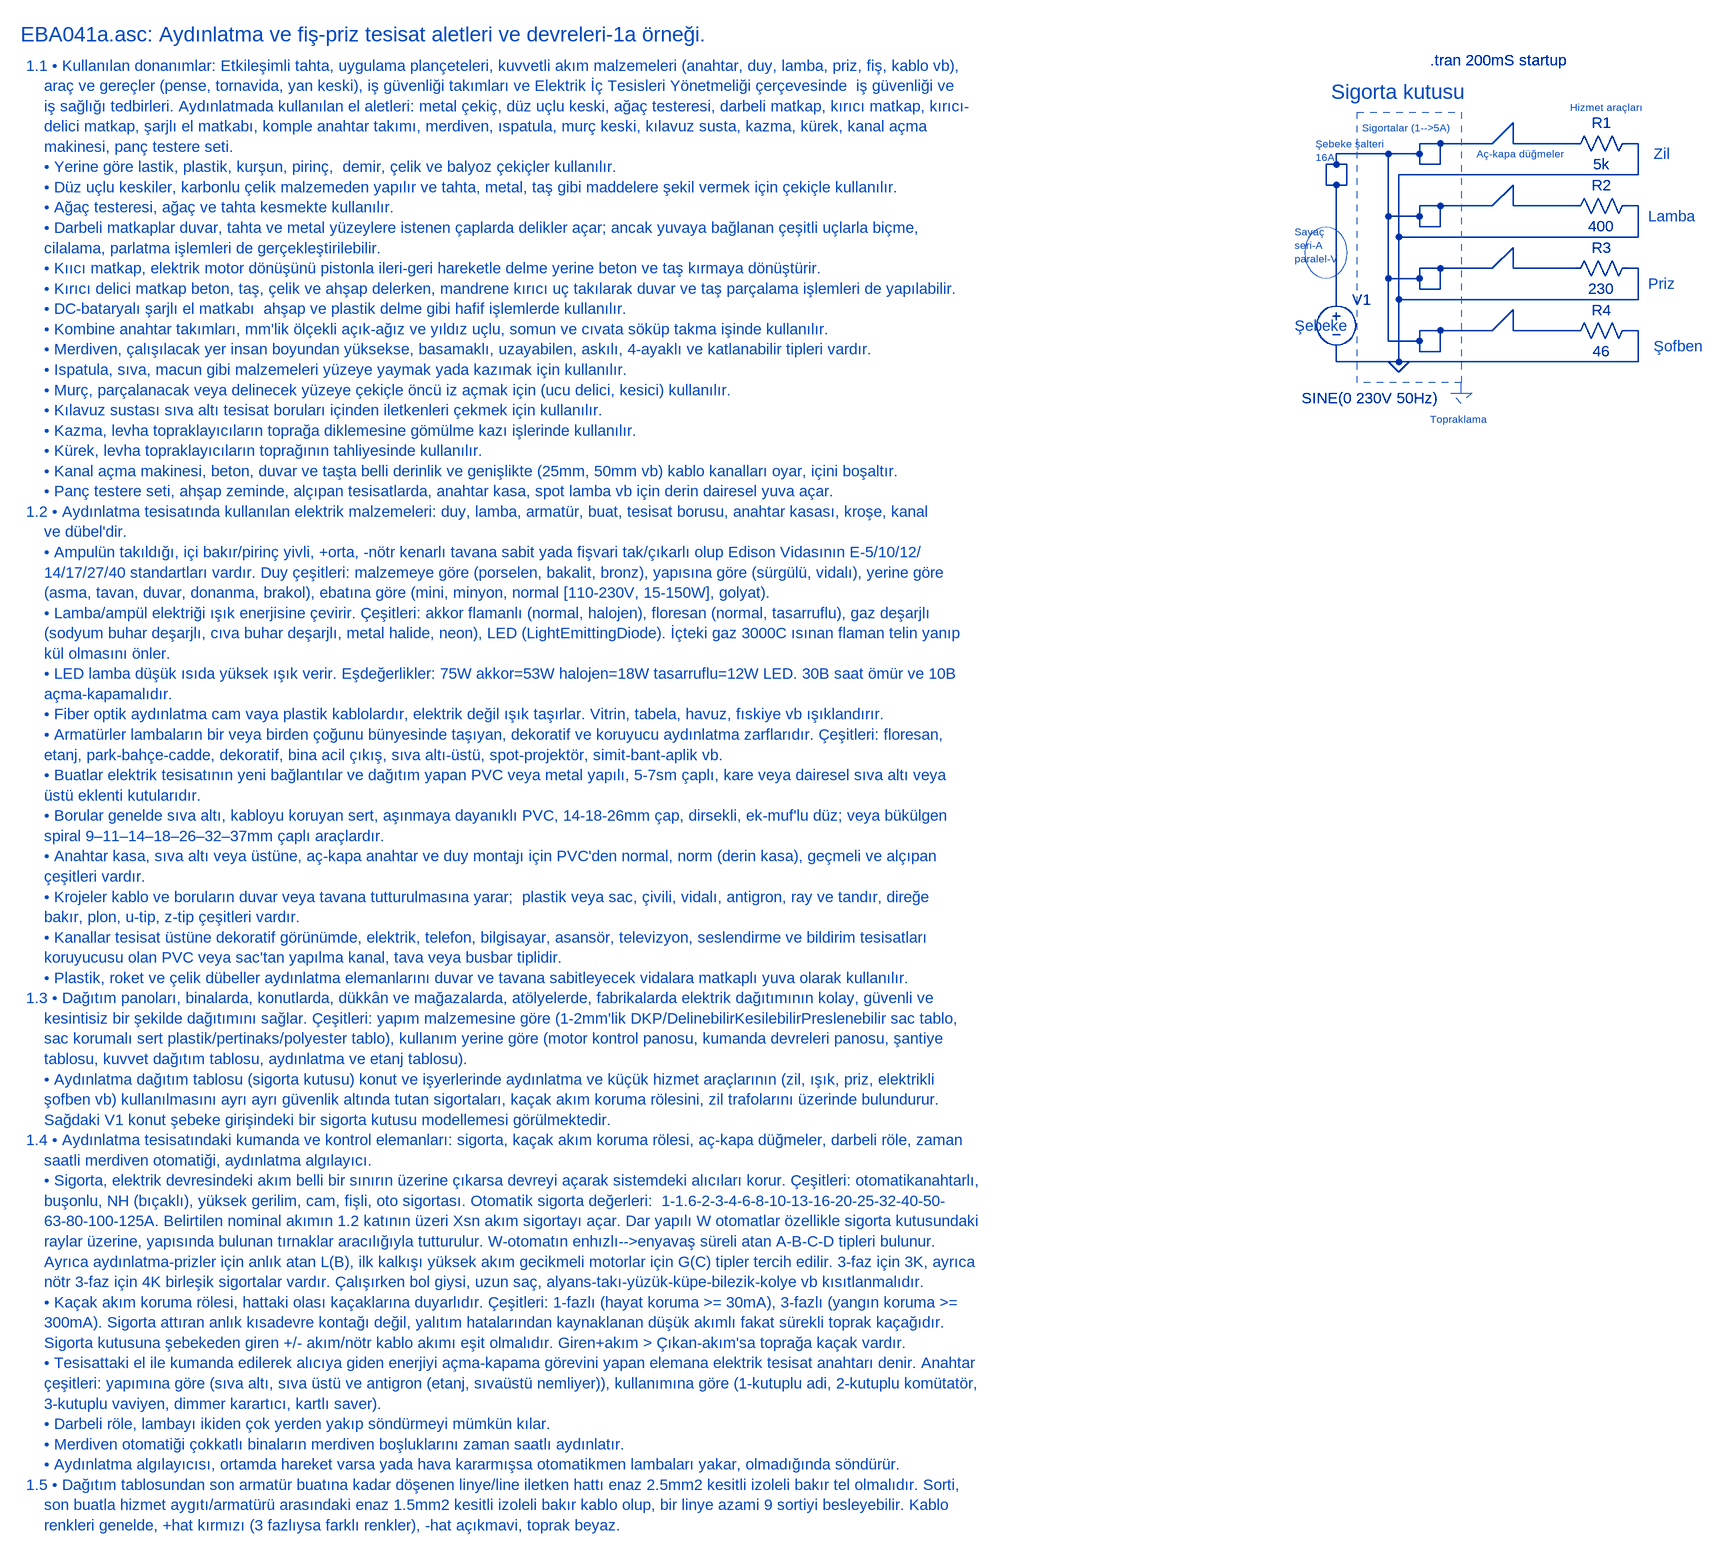
[diagram p0: schematic EBA041a.asc]
EBA041a.asc, the LTspice schematic file:
Version 4
SHEET 1 3956 2148
WIRE 2032 208 2000 208
WIRE 2112 208 2144 176
WIRE 2112 208 2032 208
WIRE 2144 208 2144 176
WIRE 2240 208 2144 208
WIRE 2336 208 2320 208
WIRE 1952 224 1872 224
WIRE 2000 224 2000 208
WIRE 2000 224 1952 224
WIRE 1872 240 1872 224
WIRE 1872 240 1856 240
WIRE 1888 240 1872 240
WIRE 2000 240 2000 224
WIRE 2032 240 2032 208
WIRE 2032 240 2000 240
WIRE 2336 256 2336 208
WIRE 2336 256 1968 256
WIRE 1856 272 1856 240
WIRE 1872 272 1856 272
WIRE 1888 272 1888 240
WIRE 1888 272 1872 272
WIRE 2032 304 2000 304
WIRE 2112 304 2144 272
WIRE 2112 304 2032 304
WIRE 2144 304 2144 272
WIRE 2240 304 2144 304
WIRE 2336 304 2320 304
WIRE 1952 320 1952 224
WIRE 2000 320 2000 304
WIRE 2000 320 1952 320
WIRE 2000 336 2000 320
WIRE 2032 336 2032 304
WIRE 2032 336 2000 336
WIRE 1968 352 1968 256
WIRE 2336 352 2336 304
WIRE 2336 352 1968 352
WIRE 2032 400 2000 400
WIRE 2112 400 2144 368
WIRE 2112 400 2032 400
WIRE 2144 400 2144 368
WIRE 2240 400 2144 400
WIRE 2336 400 2320 400
WIRE 1952 416 1952 320
WIRE 2000 416 2000 400
WIRE 2000 416 1952 416
WIRE 2000 432 2000 416
WIRE 2032 432 2032 400
WIRE 2032 432 2000 432
WIRE 1872 448 1872 272
WIRE 1968 448 1968 352
WIRE 2336 448 2336 400
WIRE 2336 448 1968 448
WIRE 2032 496 2000 496
WIRE 2112 496 2144 464
WIRE 2112 496 2032 496
WIRE 2144 496 2144 464
WIRE 2240 496 2144 496
WIRE 2336 496 2320 496
WIRE 1952 512 1952 416
WIRE 2000 512 2000 496
WIRE 2000 512 1952 512
WIRE 2000 528 2000 512
WIRE 2032 528 2032 496
WIRE 2032 528 2000 528
WIRE 1872 544 1872 528
WIRE 1968 544 1968 448
WIRE 1968 544 1872 544
WIRE 2336 544 2336 496
WIRE 2336 544 1968 544
FLAG 1968 544 0
SYMBOL voltage 1872 432 R0
WINDOW 3 -53 168 Left 2
WINDOW 123 0 0 Left 0
WINDOW 39 0 0 Left 0
SYMATTR Value SINE(0 230V 50Hz)
SYMATTR InstName V1
SYMBOL res 2336 192 R90
WINDOW 0 0 56 VBottom 2
WINDOW 3 32 56 VTop 2
SYMATTR InstName R1
SYMATTR Value 5k
SYMBOL res 2336 288 R90
WINDOW 0 0 56 VBottom 2
WINDOW 3 32 56 VTop 2
SYMATTR InstName R2
SYMATTR Value 400
SYMBOL res 2336 384 R90
WINDOW 0 0 56 VBottom 2
WINDOW 3 32 56 VTop 2
SYMATTR InstName R3
SYMATTR Value 230
SYMBOL res 2336 480 R90
WINDOW 0 0 56 VBottom 2
WINDOW 3 32 56 VTop 2
SYMATTR InstName R4
SYMATTR Value 46
TEXT -152 40 Left 3 ;EBA041a.asc: Aydınlatma ve fiş-priz tesisat aletleri ve devreleri-1a örneği.
TEXT -144 88 Left 2 ;1.1 • Kullanılan donanımlar: Etkileşimli tahta, uygulama plançeteleri, kuvvetli akım malzemeleri (anahtar, duy, lamba, priz, fiş, kablo vb),\n    araç ve gereçler (pense, tornavida, yan keski), iş güvenliği takımları ve Elektrik İç Tesisleri Yönetmeliği çerçevesinde  iş güvenliği ve\n    iş sağlığı tedbirleri. Aydınlatmada kullanılan el aletleri: metal çekiç, düz uçlu keski, ağaç testeresi, darbeli matkap, kırıcı matkap, kırıcı-\n    delici matkap, şarjlı el matkabı, komple anahtar takımı, merdiven, ıspatula, murç keski, kılavuz susta, kazma, kürek, kanal açma \n    makinesi, panç testere seti.\n    • Yerine göre lastik, plastik, kurşun, pirinç,  demir, çelik ve balyoz çekiçler kullanılır.\n    • Düz uçlu keskiler, karbonlu çelik malzemeden yapılır ve tahta, metal, taş gibi maddelere şekil vermek için çekiçle kullanılır.\n    • Ağaç testeresi, ağaç ve tahta kesmekte kullanılır.\n    • Darbeli matkaplar duvar, tahta ve metal yüzeylere istenen çaplarda delikler açar; ancak yuvaya bağlanan çeşitli uçlarla biçme, \n    cilalama, parlatma işlemleri de gerçekleştirilebilir.\n    • Kııcı matkap, elektrik motor dönüşünü pistonla ileri-geri hareketle delme yerine beton ve taş kırmaya dönüştürir.\n    • Kırıcı delici matkap beton, taş, çelik ve ahşap delerken, mandrene kırıcı uç takılarak duvar ve taş parçalama işlemleri de yapılabilir.\n    • DC-bataryalı şarjlı el matkabı  ahşap ve plastik delme gibi hafif işlemlerde kullanılır.\n    • Kombine anahtar takımları, mm'lik ölçekli açık-ağız ve yıldız uçlu, somun ve cıvata söküp takma işinde kullanılır.\n    • Merdiven, çalışılacak yer insan boyundan yüksekse, basamaklı, uzayabilen, askılı, 4-ayaklı ve katlanabilir tipleri vardır.\n    • Ispatula, sıva, macun gibi malzemeleri yüzeye yaymak yada kazımak için kullanılır.\n    • Murç, parçalanacak veya delinecek yüzeye çekiçle öncü iz açmak için (ucu delici, kesici) kullanılır.\n    • Kılavuz sustası sıva altı tesisat boruları içinden iletkenleri çekmek için kullanılır.\n    • Kazma, levha topraklayıcıların toprağa diklemesine gömülme kazı işlerinde kullanılır.\n    • Kürek, levha topraklayıcıların toprağının tahliyesinde kullanılır.\n    • Kanal açma makinesi, beton, duvar ve taşta belli derinlik ve genişlikte (25mm, 50mm vb) kablo kanalları oyar, içini boşaltır.\n    • Panç testere seti, ahşap zeminde, alçıpan tesisatlarda, anahtar kasa, spot lamba vb için derin dairesel yuva açar.\n1.2 • Aydınlatma tesisatında kullanılan elektrik malzemeleri: duy, lamba, armatür, buat, tesisat borusu, anahtar kasası, kroşe, kanal\n    ve dübel'dir.\n    • Ampulün takıldığı, içi bakır/pirinç yivli, +orta, -nötr kenarlı tavana sabit yada fişvari tak/çıkarlı olup Edison Vidasının E-5/10/12/\n    14/17/27/40 standartları vardır. Duy çeşitleri: malzemeye göre (porselen, bakalit, bronz), yapısına göre (sürgülü, vidalı), yerine göre\n    (asma, tavan, duvar, donanma, brakol), ebatına göre (mini, minyon, normal [110-230V, 15-150W], golyat).\n    • Lamba/ampül elektriği ışık enerjisine çevirir. Çeşitleri: akkor flamanlı (normal, halojen), floresan (normal, tasarruflu), gaz deşarjlı \n    (sodyum buhar deşarjlı, cıva buhar deşarjlı, metal halide, neon), LED (LightEmittingDiode). İçteki gaz 3000C ısınan flaman telin yanıp\n    kül olmasını önler.\n    • LED lamba düşük ısıda yüksek ışık verir. Eşdeğerlikler: 75W akkor=53W halojen=18W tasarruflu=12W LED. 30B saat ömür ve 10B \n    açma-kapamalıdır.\n    • Fiber optik aydınlatma cam vaya plastik kablolardır, elektrik değil ışık taşırlar. Vitrin, tabela, havuz, fıskiye vb ışıklandırır.\n    • Armatürler lambaların bir veya birden çoğunu bünyesinde taşıyan, dekoratif ve koruyucu aydınlatma zarflarıdır. Çeşitleri: floresan,\n    etanj, park-bahçe-cadde, dekoratif, bina acil çıkış, sıva altı-üstü, spot-projektör, simit-bant-aplik vb.\n    • Buatlar elektrik tesisatının yeni bağlantılar ve dağıtım yapan PVC veya metal yapılı, 5-7sm çaplı, kare veya dairesel sıva altı veya\n    üstü eklenti kutularıdır.\n    • Borular genelde sıva altı, kabloyu koruyan sert, aşınmaya dayanıklı PVC, 14-18-26mm çap, dirsekli, ek-muf'lu düz; veya bükülgen\n    spiral 9–11–14–18–26–32–37mm çaplı araçlardır.\n    • Anahtar kasa, sıva altı veya üstüne, aç-kapa anahtar ve duy montajı için PVC'den normal, norm (derin kasa), geçmeli ve alçıpan\n    çeşitleri vardır.\n    • Krojeler kablo ve boruların duvar veya tavana tutturulmasına yarar;  plastik veya sac, çivili, vidalı, antigron, ray ve tandır, direğe\n    bakır, plon, u-tip, z-tip çeşitleri vardır.\n    • Kanallar tesisat üstüne dekoratif görünümde, elektrik, telefon, bilgisayar, asansör, televizyon, seslendirme ve bildirim tesisatları\n    koruyucusu olan PVC veya sac'tan yapılma kanal, tava veya busbar tiplidir.\n    • Plastik, roket ve çelik dübeller aydınlatma elemanlarını duvar ve tavana sabitleyecek vidalara matkaplı yuva olarak kullanılır.\n1.3 • Dağıtım panoları, binalarda, konutlarda, dükkân ve mağazalarda, atölyelerde, fabrikalarda elektrik dağıtımının kolay, güvenli ve\n    kesintisiz bir şekilde dağıtımını sağlar. Çeşitleri: yapım malzemesine göre (1-2mm'lik DKP/DelinebilirKesilebilirPreslenebilir sac tablo,\n    sac korumalı sert plastik/pertinaks/polyester tablo), kullanım yerine göre (motor kontrol panosu, kumanda devreleri panosu, şantiye\n    tablosu, kuvvet dağıtım tablosu, aydınlatma ve etanj tablosu).\n    • Aydınlatma dağıtım tablosu (sigorta kutusu) konut ve işyerlerinde aydınlatma ve küçük hizmet araçlarının (zil, ışık, priz, elektrikli \n    şofben vb) kullanılmasını ayrı ayrı güvenlik altında tutan sigortaları, kaçak akım koruma rölesini, zil trafolarını üzerinde bulundurur.\n    Sağdaki V1 konut şebeke girişindeki bir sigorta kutusu modellemesi görülmektedir.\n1.4 • Aydınlatma tesisatındaki kumanda ve kontrol elemanları: sigorta, kaçak akım koruma rölesi, aç-kapa düğmeler, darbeli röle, zaman\n    saatli merdiven otomatiği, aydınlatma algılayıcı.\n    • Sigorta, elektrik devresindeki akım belli bir sınırın üzerine çıkarsa devreyi açarak sistemdeki alıcıları korur. Çeşitleri: otomatikanahtarlı,\n    buşonlu, NH (bıçaklı), yüksek gerilim, cam, fişli, oto sigortası. Otomatik sigorta değerleri:  1-1.6-2-3-4-6-8-10-13-16-20-25-32-40-50-\n    63-80-100-125A. Belirtilen nominal akımın 1.2 katının üzeri Xsn akım sigortayı açar. Dar yapılı W otomatlar özellikle sigorta kutusundaki \n    raylar üzerine, yapısında bulunan tırnaklar aracılığıyla tutturulur. W-otomatın enhızlı-->enyavaş süreli atan A-B-C-D tipleri bulunur.\n    Ayrıca aydınlatma-prizler için anlık atan L(B), ilk kalkışı yüksek akım gecikmeli motorlar için G(C) tipler tercih edilir. 3-faz için 3K, ayrıca\n    nötr 3-faz için 4K birleşik sigortalar vardır. Çalışırken bol giysi, uzun saç, alyans-takı-yüzük-küpe-bilezik-kolye vb kısıtlanmalıdır.\n    • Kaçak akım koruma rölesi, hattaki olası kaçaklarına duyarlıdır. Çeşitleri: 1-fazlı (hayat koruma >= 30mA), 3-fazlı (yangın koruma >=\n    300mA). Sigorta attıran anlık kısadevre kontağı değil, yalıtım hatalarından kaynaklanan düşük akımlı fakat sürekli toprak kaçağıdır.\n    Sigorta kutusuna şebekeden giren +/- akım/nötr kablo akımı eşit olmalıdır. Giren+akım > Çıkan-akım'sa toprağa kaçak vardır.\n    • Tesisattaki el ile kumanda edilerek alıcıya giden enerjiyi açma-kapama görevini yapan elemana elektrik tesisat anahtarı denir. Anahtar\n    çeşitleri: yapımına göre (sıva altı, sıva üstü ve antigron (etanj, sıvaüstü nemliyer)), kullanımına göre (1-kutuplu adi, 2-kutuplu komütatör,\n    3-kutuplu vaviyen, dimmer karartıcı, kartlı saver).\n    • Darbeli röle, lambayı ikiden çok yerden yakıp söndürmeyi mümkün kılar.\n    • Merdiven otomatiği çokkatlı binaların merdiven boşluklarını zaman saatlı aydınlatır.\n    • Aydınlatma algılayıcısı, ortamda hareket varsa yada hava kararmışsa otomatikmen lambaları yakar, olmadığında söndürür.\n1.5 • Dağıtım tablosundan son armatür buatına kadar döşenen linye/line iletken hattı enaz 2.5mm2 kesitli izoleli bakır tel olmalıdır. Sorti, \n    son buatla hizmet aygıtı/armatürü arasındaki enaz 1.5mm2 kesitli izoleli bakır kablo olup, bir linye azami 9 sortiyi besleyebilir. Kablo \n    renkleri genelde, +hat kırmızı (3 fazlıysa farklı renkler), -hat açıkmavi, toprak beyaz.
TEXT 1912 184 Left 1 ;Sigortalar (1-->5A)
TEXT 2088 224 Left 1 ;Aç-kapa düğmeler
TEXT 2232 152 Left 1 ;Hizmet araçları
TEXT 2360 224 Left 2 ;Zil
TEXT 2352 320 Left 2 ;Lamba
TEXT 2352 424 Left 2 ;Priz
TEXT 2360 520 Left 2 ;Şofben
TEXT 1864 128 Left 3 ;Sigorta kutusu
TEXT 2016 632 Left 1 ;Topraklama
TEXT 2016 80 Left 2 !.tran 200mS startup
TEXT 1808 344 Left 1 ;Sayaç\nseri-A\nparalel-V
TEXT 1840 208 Left 1 ;Şebeke şalteri\n16A
TEXT 1808 488 Left 2 ;Şebeke
LINE Normal 2064 592 2064 576 2
LINE Normal 2048 592 2064 592 2
LINE Normal 2064 608 2048 592 2
LINE Normal 2080 592 2064 608 2
LINE Normal 2064 592 2080 592 2
RECTANGLE Normal 2064 576 1904 160 2
CIRCLE Normal 1888 416 1824 336 2

The netlist it stands for:
* EBA041a.asc
V1 N001 0 SINE(0 230V 50Hz)
R1 0 N001 5k
R2 0 N001 400
R3 0 N001 230
R4 0 N001 46
* EBA041a.asc: Aydınlatma ve fiş-priz tesisat aletleri ve devreleri-1a örneği.
* 1.1 • Kullanılan donanımlar: Etkileşimli tahta, uygulama plançeteleri, kuvvetli akım malzemeleri (anahtar, duy, lamba, priz, fiş, kablo vb),
*     araç ve gereçler (pense, tornavida, yan keski), iş güvenliği takımları ve Elektrik İç Tesisleri Yönetmeliği çerçevesinde  iş güvenliği ve
*     iş sağlığı tedbirleri. Aydınlatmada kullanılan el aletleri: metal çekiç, düz uçlu keski, ağaç testeresi, darbeli matkap, kırıcı matkap, kırıcı-
*     delici matkap, şarjlı el matkabı, komple anahtar takımı, merdiven, ıspatula, murç keski, kılavuz susta, kazma, kürek, kanal açma
*     makinesi, panç testere seti.
*     • Yerine göre lastik, plastik, kurşun, pirinç,  demir, çelik ve balyoz çekiçler kullanılır.
*     • Düz uçlu keskiler, karbonlu çelik malzemeden yapılır ve tahta, metal, taş gibi maddelere şekil vermek için çekiçle kullanılır.
*     • Ağaç testeresi, ağaç ve tahta kesmekte kullanılır.
*     • Darbeli matkaplar duvar, tahta ve metal yüzeylere istenen çaplarda delikler açar; ancak yuvaya bağlanan çeşitli uçlarla biçme,
*     cilalama, parlatma işlemleri de gerçekleştirilebilir.
*     • Kııcı matkap, elektrik motor dönüşünü pistonla ileri-geri hareketle delme yerine beton ve taş kırmaya dönüştürir.
*     • Kırıcı delici matkap beton, taş, çelik ve ahşap delerken, mandrene kırıcı uç takılarak duvar ve taş parçalama işlemleri de yapılabilir.
*     • DC-bataryalı şarjlı el matkabı  ahşap ve plastik delme gibi hafif işlemlerde kullanılır.
*     • Kombine anahtar takımları, mm'lik ölçekli açık-ağız ve yıldız uçlu, somun ve cıvata söküp takma işinde kullanılır.
*     • Merdiven, çalışılacak yer insan boyundan yüksekse, basamaklı, uzayabilen, askılı, 4-ayaklı ve katlanabilir tipleri vardır.
*     • Ispatula, sıva, macun gibi malzemeleri yüzeye yaymak yada kazımak için kullanılır.
*     • Murç, parçalanacak veya delinecek yüzeye çekiçle öncü iz açmak için (ucu delici, kesici) kullanılır.
*     • Kılavuz sustası sıva altı tesisat boruları içinden iletkenleri çekmek için kullanılır.
*     • Kazma, levha topraklayıcıların toprağa diklemesine gömülme kazı işlerinde kullanılır.
*     • Kürek, levha topraklayıcıların toprağının tahliyesinde kullanılır.
*     • Kanal açma makinesi, beton, duvar ve taşta belli derinlik ve genişlikte (25mm, 50mm vb) kablo kanalları oyar, içini boşaltır.
*     • Panç testere seti, ahşap zeminde, alçıpan tesisatlarda, anahtar kasa, spot lamba vb için derin dairesel yuva açar.
* 1.2 • Aydınlatma tesisatında kullanılan elektrik malzemeleri: duy, lamba, armatür, buat, tesisat borusu, anahtar kasası, kroşe, kanal
*     ve dübel'dir.
*     • Ampulün takıldığı, içi bakır/pirinç yivli, +orta, -nötr kenarlı tavana sabit yada fişvari tak/çıkarlı olup Edison Vidasının E-5/10/12/
*     14/17/27/40 standartları vardır. Duy çeşitleri: malzemeye göre (porselen, bakalit, bronz), yapısına göre (sürgülü, vidalı), yerine göre
*     (asma, tavan, duvar, donanma, brakol), ebatına göre (mini, minyon, normal [110-230V, 15-150W], golyat).
*     • Lamba/ampül elektriği ışık enerjisine çevirir. Çeşitleri: akkor flamanlı (normal, halojen), floresan (normal, tasarruflu), gaz deşarjlı
*     (sodyum buhar deşarjlı, cıva buhar deşarjlı, metal halide, neon), LED (LightEmittingDiode). İçteki gaz 3000C ısınan flaman telin yanıp
*     kül olmasını önler.
*     • LED lamba düşük ısıda yüksek ışık verir. Eşdeğerlikler: 75W akkor=53W halojen=18W tasarruflu=12W LED. 30B saat ömür ve 10B
*     açma-kapamalıdır.
*     • Fiber optik aydınlatma cam vaya plastik kablolardır, elektrik değil ışık taşırlar. Vitrin, tabela, havuz, fıskiye vb ışıklandırır.
*     • Armatürler lambaların bir veya birden çoğunu bünyesinde taşıyan, dekoratif ve koruyucu aydınlatma zarflarıdır. Çeşitleri: floresan,
*     etanj, park-bahçe-cadde, dekoratif, bina acil çıkış, sıva altı-üstü, spot-projektör, simit-bant-aplik vb.
*     • Buatlar elektrik tesisatının yeni bağlantılar ve dağıtım yapan PVC veya metal yapılı, 5-7sm çaplı, kare veya dairesel sıva altı veya
*     üstü eklenti kutularıdır.
*     • Borular genelde sıva altı, kabloyu koruyan sert, aşınmaya dayanıklı PVC, 14-18-26mm çap, dirsekli, ek-muf'lu düz; veya bükülgen
*     spiral 9–11–14–18–26–32–37mm çaplı araçlardır.
*     • Anahtar kasa, sıva altı veya üstüne, aç-kapa anahtar ve duy montajı için PVC'den normal, norm (derin kasa), geçmeli ve alçıpan
*     çeşitleri vardır.
*     • Krojeler kablo ve boruların duvar veya tavana tutturulmasına yarar;  plastik veya sac, çivili, vidalı, antigron, ray ve tandır, direğe
*     bakır, plon, u-tip, z-tip çeşitleri vardır.
*     • Kanallar tesisat üstüne dekoratif görünümde, elektrik, telefon, bilgisayar, asansör, televizyon, seslendirme ve bildirim tesisatları
*     koruyucusu olan PVC veya sac'tan yapılma kanal, tava veya busbar tiplidir.
*     • Plastik, roket ve çelik dübeller aydınlatma elemanlarını duvar ve tavana sabitleyecek vidalara matkaplı yuva olarak kullanılır.
* 1.3 • Dağıtım panoları, binalarda, konutlarda, dükkân ve mağazalarda, atölyelerde, fabrikalarda elektrik dağıtımının kolay, güvenli ve
*     kesintisiz bir şekilde dağıtımını sağlar. Çeşitleri: yapım malzemesine göre (1-2mm'lik DKP/DelinebilirKesilebilirPreslenebilir sac tablo,
*     sac korumalı sert plastik/pertinaks/polyester tablo), kullanım yerine göre (motor kontrol panosu, kumanda devreleri panosu, şantiye
*     tablosu, kuvvet dağıtım tablosu, aydınlatma ve etanj tablosu).
*     • Aydınlatma dağıtım tablosu (sigorta kutusu) konut ve işyerlerinde aydınlatma ve küçük hizmet araçlarının (zil, ışık, priz, elektrikli
*     şofben vb) kullanılmasını ayrı ayrı güvenlik altında tutan sigortaları, kaçak akım koruma rölesini, zil trafolarını üzerinde bulundurur.
*     Sağdaki V1 konut şebeke girişindeki bir sigorta kutusu modellemesi görülmektedir.
* 1.4 • Aydınlatma tesisatındaki kumanda ve kontrol elemanları: sigorta, kaçak akım koruma rölesi, aç-kapa düğmeler, darbeli röle, zaman
*     saatli merdiven otomatiği, aydınlatma algılayıcı.
*     • Sigorta, elektrik devresindeki akım belli bir sınırın üzerine çıkarsa devreyi açarak sistemdeki alıcıları korur. Çeşitleri: otomatikanahtarlı,
*     buşonlu, NH (bıçaklı), yüksek gerilim, cam, fişli, oto sigortası. Otomatik sigorta değerleri:  1-1.6-2-3-4-6-8-10-13-16-20-25-32-40-50-
*     63-80-100-125A. Belirtilen nominal akımın 1.2 katının üzeri Xsn akım sigortayı açar. Dar yapılı W otomatlar özellikle sigorta kutusundaki
*     raylar üzerine, yapısında bulunan tırnaklar aracılığıyla tutturulur. W-otomatın enhızlı-->enyavaş süreli atan A-B-C-D tipleri bulunur.
*     Ayrıca aydınlatma-prizler için anlık atan L(B), ilk kalkışı yüksek akım gecikmeli motorlar için G(C) tipler tercih edilir. 3-faz için 3K, ayrıca
*     nötr 3-faz için 4K birleşik sigortalar vardır. Çalışırken bol giysi, uzun saç, alyans-takı-yüzük-küpe-bilezik-kolye vb kısıtlanmalıdır.
*     • Kaçak akım koruma rölesi, hattaki olası kaçaklarına duyarlıdır. Çeşitleri: 1-fazlı (hayat koruma >= 30mA), 3-fazlı (yangın koruma >=
*     300mA). Sigorta attıran anlık kısadevre kontağı değil, yalıtım hatalarından kaynaklanan düşük akımlı fakat sürekli toprak kaçağıdır.
*     Sigorta kutusuna şebekeden giren +/- akım/nötr kablo akımı eşit olmalıdır. Giren+akım > Çıkan-akım'sa toprağa kaçak vardır.
*     • Tesisattaki el ile kumanda edilerek alıcıya giden enerjiyi açma-kapama görevini yapan elemana elektrik tesisat anahtarı denir. Anahtar
*     çeşitleri: yapımına göre (sıva altı, sıva üstü ve antigron (etanj, sıvaüstü nemliyer)), kullanımına göre (1-kutuplu adi, 2-kutuplu komütatör,
*     3-kutuplu vaviyen, dimmer karartıcı, kartlı saver).
*     • Darbeli röle, lambayı ikiden çok yerden yakıp söndürmeyi mümkün kılar.
*     • Merdiven otomatiği çokkatlı binaların merdiven boşluklarını zaman saatlı aydınlatır.
*     • Aydınlatma algılayıcısı, ortamda hareket varsa yada hava kararmışsa otomatikmen lambaları yakar, olmadığında söndürür.
* 1.5 • Dağıtım tablosundan son armatür buatına kadar döşenen linye/line iletken hattı enaz 2.5mm2 kesitli izoleli bakır tel olmalıdır. Sorti,
*     son buatla hizmet aygıtı/armatürü arasındaki enaz 1.5mm2 kesitli izoleli bakır kablo olup, bir linye azami 9 sortiyi besleyebilir. Kablo
*     renkleri genelde, +hat kırmızı (3 fazlıysa farklı renkler), -hat açıkmavi, toprak beyaz.
* Sigortalar (1-->5A)
* Aç-kapa düğmeler
* Hizmet araçları
* Zil
* Lamba
* Priz
* Şofben
* Sigorta kutusu
* Topraklama
.tran 200mS startup
* Sayaç
* seri-A
* paralel-V
* Şebeke şalteri
* 16A
* Şebeke
.backanno
.end